# EAGLE design 10BASE-T1L_3 (EAGLE 9.6.2)

## Sheet 1 of 2
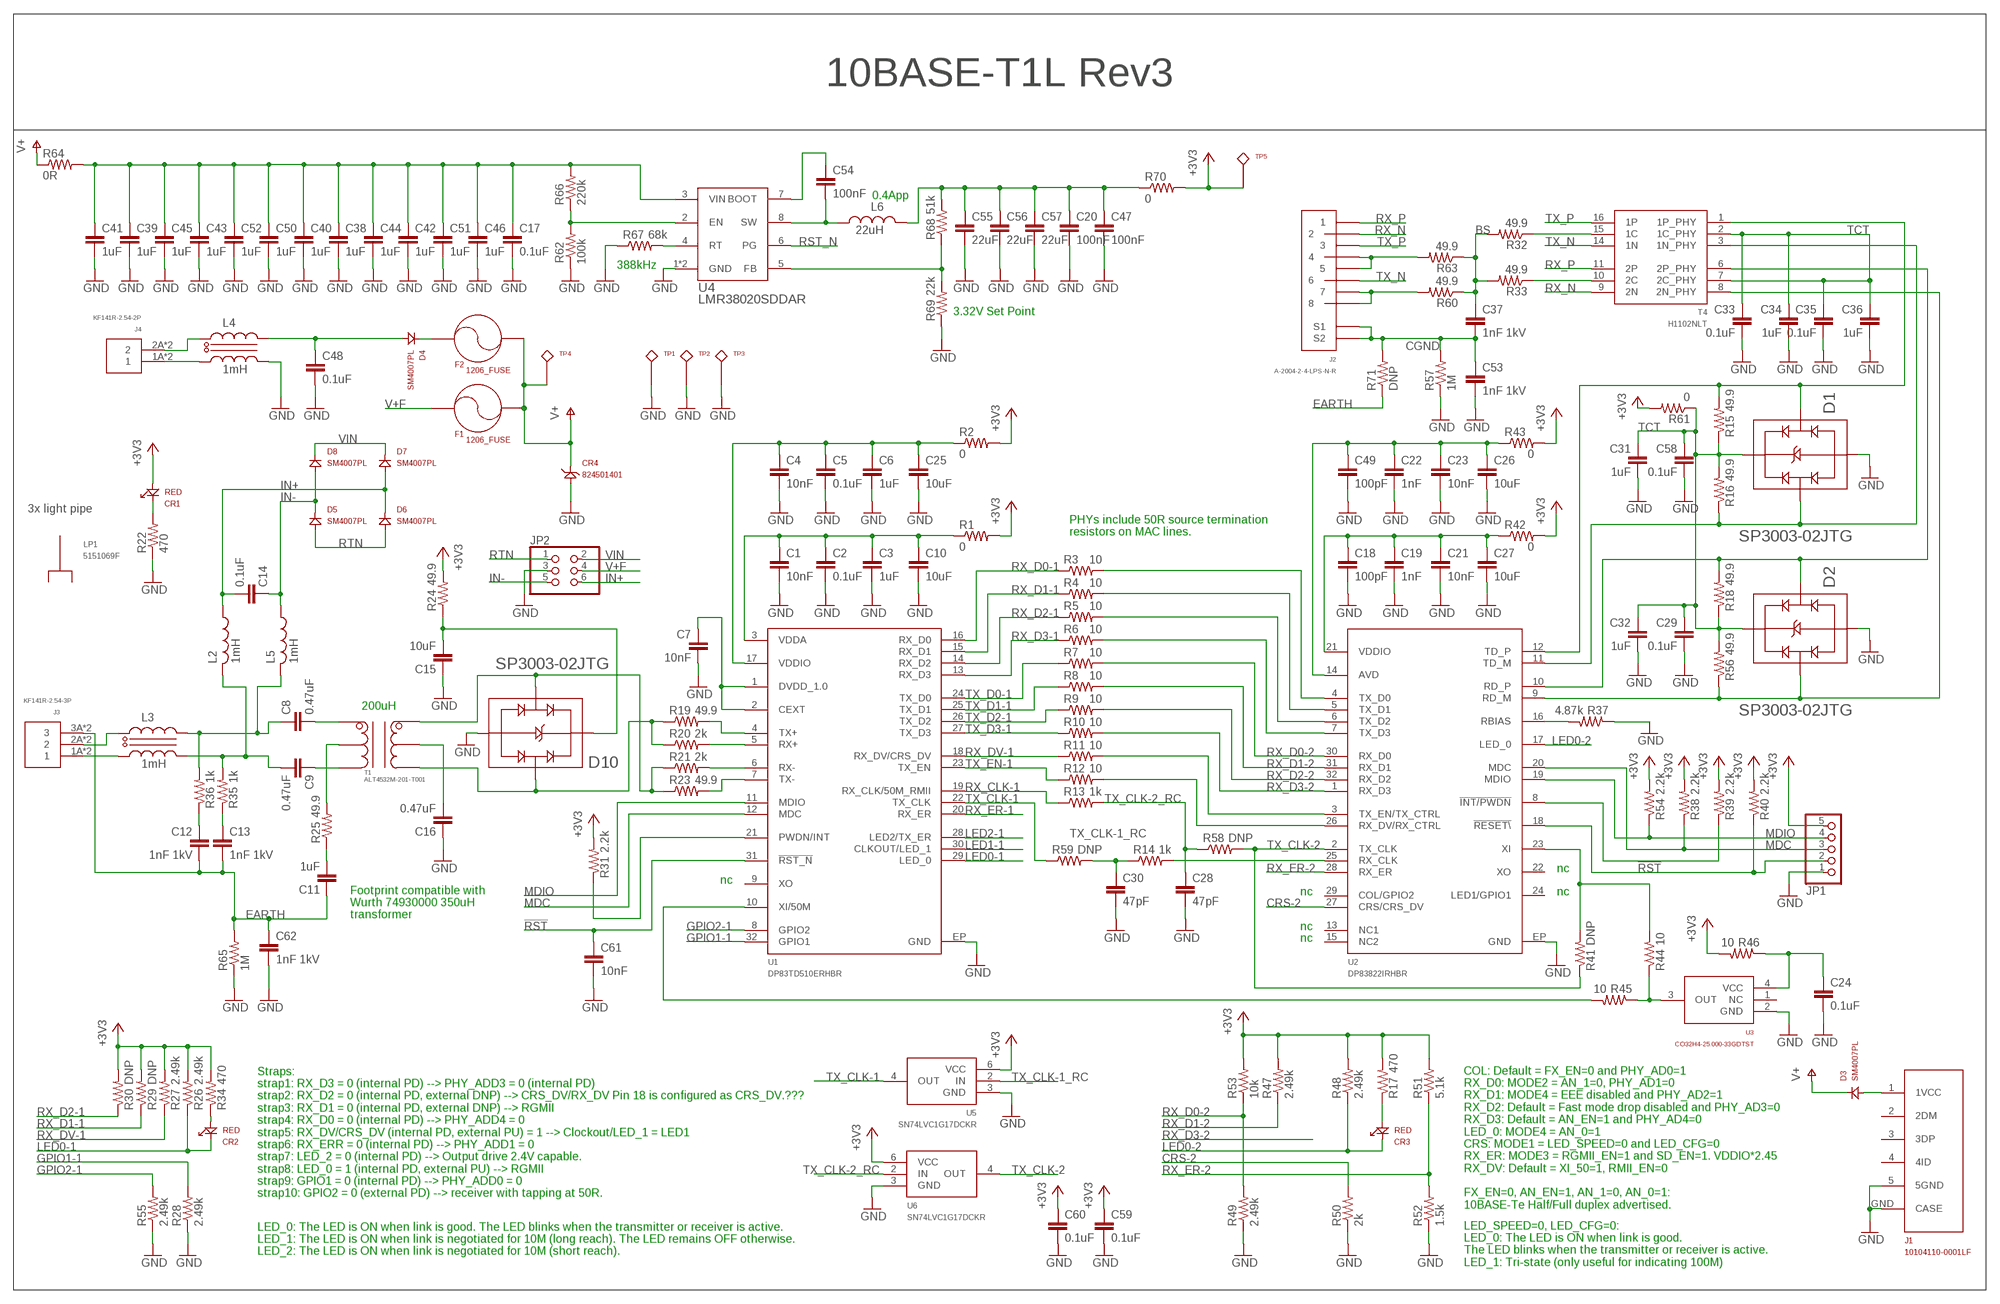
[diagram p0: schematic, sheet 1]

### Parts
C1  10nF  0402_CAPACITOR  [0402_INDUCTOR]
C2  0.1uF  0402_CAPACITOR  [0402_INDUCTOR]
C3  1uF  0402_CAPACITOR  [0402_INDUCTOR]
C4  10nF  0402_CAPACITOR  [0402_INDUCTOR]
C5  0.1uF  0402_CAPACITOR  [0402_INDUCTOR]
C6  1uF  0402_CAPACITOR  [0402_INDUCTOR]
C7  10nF  0402_CAPACITOR  [0402_INDUCTOR]
C8  0.47uF  0603_CAPACITOR  [0603]
C9  0.47uF  0603_CAPACITOR  [0603]
C10  10uF  0603_CAPACITOR  [0603]
C11  1uF  0603_CAPACITOR  [0603]
C12  1nF 1kV  C-EUC1206  [C1206]
C13  1nF 1kV  C-EUC1206  [C1206]
C14  0.1uF  0603_CAPACITOR  [0603]
C15  10uF  0603_CAPACITOR  [0603]
C16  0.47uF  0603_CAPACITOR  [0603]
C17  0.1uF  0603_CAPACITOR  [0603]
C18  100pF  0402_CAPACITOR  [0402_INDUCTOR]
C19  1nF  0402_CAPACITOR  [0402_INDUCTOR]
C20  100nF  0603_CAPACITOR  [0603]
C21  10nF  0402_CAPACITOR  [0402_INDUCTOR]
C22  1nF  0402_CAPACITOR  [0402_INDUCTOR]
C23  10nF  0402_CAPACITOR  [0402_INDUCTOR]
C24  0.1uF  0402_CAPACITOR  [0402_INDUCTOR]
C25  10uF  0603_CAPACITOR  [0603]
C26  10uF  0603_CAPACITOR  [0603]
C27  10uF  0603_CAPACITOR  [0603]
C28  47pF  0402_CAPACITOR  [0402_INDUCTOR]
C29  0.1uF  0402_CAPACITOR  [0402_INDUCTOR]
C30  47pF  0402_CAPACITOR  [0402_INDUCTOR]
C31  1uF  0402_CAPACITOR  [0402_INDUCTOR]
C32  1uF  0402_CAPACITOR  [0402_INDUCTOR]
C33  0.1uF  0402_CAPACITOR  [0402_INDUCTOR]
C34  1uF  0402_CAPACITOR  [0402_INDUCTOR]
C35  0.1uF  0402_CAPACITOR  [0402_INDUCTOR]
C36  1uF  0402_CAPACITOR  [0402_INDUCTOR]
C37  1nF 1kV  C-EUC1206  [C1206]
C38  1uF  C-EUC1206  [C1206]
C39  1uF  C-EUC1206  [C1206]
C40  1uF  C-EUC1206  [C1206]
C41  1uF  C-EUC1206  [C1206]
C42  1uF  C-EUC1206  [C1206]
C43  1uF  C-EUC1206  [C1206]
C44  1uF  C-EUC1206  [C1206]
C45  1uF  C-EUC1206  [C1206]
C46  1uF  C-EUC1206  [C1206]
C47  100nF  0603_CAPACITOR  [0603]
C48  0.1uF  0603_CAPACITOR  [0603]
C49  100pF  0402_CAPACITOR  [0402_INDUCTOR]
C50  1uF  C-EUC1206  [C1206]
C51  1uF  C-EUC1206  [C1206]
C52  1uF  C-EUC1206  [C1206]
C53  1nF 1kV  C-EUC1206  [C1206]
C54  100nF  0603_CAPACITOR  [0603]
C55  22uF  C-EUC1206  [C1206]
C56  22uF  C-EUC1206  [C1206]
C57  22uF  C-EUC1206  [C1206]
C58  0.1uF  0402_CAPACITOR  [0402_INDUCTOR]
C59  0.1uF  0402_CAPACITOR  [0402_INDUCTOR]
C60  0.1uF  0402_CAPACITOR  [0402_INDUCTOR]
C61  10nF  0402_CAPACITOR  [0402_INDUCTOR]
C62  1nF 1kV  C-EUC1206  [C1206]
CR1  RED  150060RS75000  [0603_DIODE]
CR2  RED  150060RS75000  [0603_DIODE]
CR3  RED  150060RS75000  [0603_DIODE]
CR4  824501401  [DO-214AC]
D1  SP3003-02JTG  [SC-70-5]
D2  SP3003-02JTG  [SC-70-5]
D3  SM4007PL  [SOD123(AK)]
D4  SM4007PL  [SOD123(AK)]
D5  SM4007PL  [SOD123(AK)]
D6  SM4007PL  [SOD123(AK)]
D7  SM4007PL  [SOD123(AK)]
D8  SM4007PL  [SOD123(AK)]
D10  SP3003-02JTG  [SC-70-5]
F1  1206_FUSE  [1206]
F2  1206_FUSE  [1206]
J1  10104110-0001LF  [MICRO_USB]
J2  A-2004-2-4-LPS-N-R  [A-2004-2-4-LPS-N-R]
J3  KF141R-2.54-3P  [KF141R-2.54-3P]
J4  KF141R-2.54-2P  [KF141R-2.54-2P]
JP1  PINHD-1X5  [1X05]
JP2  PINHD-2X3  [2X03]
L2  1mH  SNR5040TYD102M  [SNR5040]
L3  1mH  SMCM090605-102  [SMCM090605]
L4  1mH  SMCM090605-102  [SMCM090605]
L5  1mH  SNR5040TYD102M  [SNR5040]
L6  22uH  TMPC0603H-220MG-D  [TMPC0603H]
LP1  5151069F  [5151069F]
R1  0  0603_RESISTOR  [0603]
R2  0  0603_RESISTOR  [0603]
R3  10  0402_RESISTOR  [R0402]
R4  10  0402_RESISTOR  [R0402]
R5  10  0402_RESISTOR  [R0402]
R6  10  0402_RESISTOR  [R0402]
R7  10  0402_RESISTOR  [R0402]
R8  10  0402_RESISTOR  [R0402]
R9  10  0402_RESISTOR  [R0402]
R10  10  0402_RESISTOR  [R0402]
R11  10  0402_RESISTOR  [R0402]
R12  10  0402_RESISTOR  [R0402]
R13  1k  0402_RESISTOR  [R0402]
R14  1k  0402_RESISTOR  [R0402]
R15  49.9  0402_RESISTOR  [R0402]
R16  49.9  0402_RESISTOR  [R0402]
R17  470  0603_RESISTOR  [0603]
R18  49.9  0402_RESISTOR  [R0402]
R19  49.9  0402_RESISTOR  [R0402]
R20  2k  0402_RESISTOR  [R0402]
R21  2k  0402_RESISTOR  [R0402]
R22  470  0603_RESISTOR  [0603]
R23  49.9  0402_RESISTOR  [R0402]
R24  49.9  0603_RESISTOR  [0603]
R25  49.9  0603_RESISTOR  [0603]
R26  2.49k  0402_RESISTOR  [R0402]
R27  2.49k  0402_RESISTOR  [R0402]
R28  2.49k  0402_RESISTOR  [R0402]
R29  DNP  0402_RESISTOR  [R0402]
R30  DNP  0402_RESISTOR  [R0402]
R31  2.2k  0402_RESISTOR  [R0402]
R32  49.9  0402_RESISTOR  [R0402]
R33  49.9  0402_RESISTOR  [R0402]
R34  470  0603_RESISTOR  [0603]
R35  1k  0603_RESISTOR  [0603]
R36  1k  0603_RESISTOR  [0603]
R37  4.87k  0402_RESISTOR  [R0402]
R38  2.2k  0402_RESISTOR  [R0402]
R39  2.2k  0402_RESISTOR  [R0402]
R40  2.2k  0402_RESISTOR  [R0402]
R41  DNP  0402_RESISTOR  [R0402]
R42  0  0603_RESISTOR  [0603]
R43  0  0603_RESISTOR  [0603]
R44  10  0402_RESISTOR  [R0402]
R45  10  0402_RESISTOR  [R0402]
R46  10  0402_RESISTOR  [R0402]
R47  2.49k  0402_RESISTOR  [R0402]
R48  2.49k  0402_RESISTOR  [R0402]
R49  2.49k  0402_RESISTOR  [R0402]
R50  2k  0402_RESISTOR  [R0402]
R51  5.1k  0402_RESISTOR  [R0402]
R52  1.5k  0402_RESISTOR  [R0402]
R53  10k  0402_RESISTOR  [R0402]
R54  2.2k  0402_RESISTOR  [R0402]
R55  2.49k  0402_RESISTOR  [R0402]
R56  49.9  0402_RESISTOR  [R0402]
R57  1M  1206_RESISTOR  [1206]
R58  DNP  0402_RESISTOR  [R0402]
R59  DNP  0402_RESISTOR  [R0402]
R60  49.9  0402_RESISTOR  [R0402]
R61  0  0603_RESISTOR  [0603]
R62  100k  0603_RESISTOR  [0603]
R63  49.9  0402_RESISTOR  [R0402]
R64  0R  1206_RESISTOR  [1206]
R65  1M  1206_RESISTOR  [1206]
R66  220k  0603_RESISTOR  [0603]
R67  68k  0603_RESISTOR  [0603]
R68  51k  0603_RESISTOR  [0603]
R69  22k  0603_RESISTOR  [0603]
R70  0  0603_RESISTOR  [0603]
R71  DNP  0603_RESISTOR  [0603]
T1  ALT4532M-201-T001  [TDK_ALT]
T4  H1102NLT  [H1102NLT]
TP1  5011  [5010]
TP2  5011  [5010]
TP3  5011  [5010]
TP4  5010  [5010]
TP5  5010  [5010]
U1  DP83TD510ERHBR  [QFN32-55_TI]
U2  DP83822IRHBR  [QFN32-55_TI]
U3  CO32H4-25.000-33GDTST  [3.2X2.5_4SMD]
U4  LMR38020SDDAR  [SOIC8_TP_TI]
U5  SN74LVC1G17DCKR  [SC-70]
U6  SN74LVC1G17DCKR  [SC-70]

### Nets
3V3R: C20.1 C47.1 C55.1 C56.1 C57.1 L6.P$1 R68.2 R70.1
!RST [Diff]: C61.P$1 JP1.2 R40.1 U1.31(!RST_N) U2.18(!RESET\)
+3V3: C59.P$1 C60.P$1 CR1.A JP1.5 R1.2 R2.2 R17.2 R24.2 R26.2 R27.2 R29.2 R30.2 R31.2 R34.2 R38.2 R39.2 R40.2 R42.2 R43.2 R46.2 R47.2 R48.2 R51.2 R53.2 R54.2 R61.2 R70.2 TP5.P$1 U5.6(VCC) U6.6(VCC)
BS: C37.1 R32.2 R33.2 R60.1 R63.1
CEXT_L: C7.P$1 U1.1(DVDD_1.0) U1.2(CEXT)
CGND: C37.2 C53.1 J2.S1 J2.S2 R57.2 R71.2
CRS-2: R50.2 U2.27(CRS/CRS_DV)
EARTH: C11.1 C12.2 C13.2 C62.1 J3.3A J3.3B R65.2 R71.1
GND: C1.P$2 C2.P$2 C3.P$2 C4.P$2 C5.P$2 C6.P$2 C7.P$2 C10.2 C15.1 C16.1 C17.2 C18.P$2 C19.P$2 C20.2 C21.P$2 C22.P$2 C23.P$2 C24.P$2 C25.2 C26.2 C27.2 C28.P$2 C29.P$2 C30.P$2 C31.P$2 C32.P$2 C33.P$2 C34.P$2 C35.P$2 C36.P$2 C38.2 C39.2 C40.2 C41.2 C42.2 C43.2 C44.2 C45.2 C46.2 C47.2 C48.2 C49.P$2 C50.2 C51.2 C52.2 C53.2 C55.2 C56.2 C57.2 C58.P$2 C59.P$2 C60.P$2 C61.P$2 C62.2 CR4.A D1.2(GND) D2.2(GND) D10.2(GND) J1.5(5GND) J1.GND(CASE) JP1.1 JP2.3 L4.OUT2(2OUT) R22.1 R28.1 R37.1 R49.1 R50.1 R52.1 R55.1 R57.1 R62.1 R65.1 R67.1 R69.1 TP1.P$1 TP2.P$1 TP3.P$1 U1.EP(GND) U2.EP(GND) U3.2(GND) U4.1(GND) U4.TP(GND) U5.3(GND) U6.3(GND)
GPIO1-1: R28.2 U1.32(GPIO1)
GPIO2-1: R55.2 U1.8(GPIO2)
IN+: C14.2 D6.K D7.A JP2.6 L2.P$1
IN+L: C9.2 L2.P$2 L3.OUT2(2OUT) R35.2
IN-: C14.1 D5.K D8.A JP2.5 L5.P$1
IN-L: C8.1 L3.OUT1(1OUT) L5.P$2 R36.2
LED0-1: CR2.K R26.1 U1.29(LED_0)
LED0-2: CR3.K R48.1 U2.17(LED_0)
LED1-1: U1.30(CLKOUT/LED_1)
LED2-1: U1.28(LED2/TX_ER)
MDC: JP1.3 R38.1 U1.12(MDC) U2.20(MDC)
MDIO: JP1.4 R54.1 U1.11(MDIO) U2.19(MDIO)
N$1: C48.1 D4.A L4.OUT1(1OUT)
N$2: C8.2 T1.1
N$3: CR3.A R17.1
N$4: J2.4 J2.5 R63.2
N$5: J2.7 J2.8 R60.2
N$6: CR2.A R34.1
N$9: R31.1 U1.21(PWDN/INT)
N$10: D3.A J1.1(1VCC)
N$12: J4.1A J4.1B L4.IN2(2IN)
N$13: R14.2 U2.25(RX_CLK)
N$14: C9.1 T1.2
N$16: R25.2 T1.6
N$19: CR1.K R22.2
N$23: D4.K F2.1
N$24: R12.2 U2.26(RX_DV/RX_CTRL)
N$25: R11.2 U2.3(TX_EN/TX_CTRL)
N$27: R62.2 R66.1 U4.2(EN)
N$29: R32.1 T4.15(1C)
N$30: R6.2 U2.7(TX_D3)
N$31: R5.2 U2.6(TX_D2)
N$32: R4.2 U2.5(TX_D1)
N$33: R3.2 U2.4(TX_D0)
N$34: J4.2A J4.2B L4.IN1(1IN)
N$36: J3.1A J3.1B L3.IN2(2IN)
N$37: C11.2 R25.1
N$38: R41.2 R44.2 U2.23(XI)
N$40: C16.2 T1.3
N$42: C12.1 R36.1
N$48: C13.1 R35.1
N$49: J3.2A J3.2B L3.IN1(1IN)
N$50: C15.2 D10.3(VCC) R24.1
N$58: R39.1 U2.8(!INT/PWDN)
N$59: R68.1 R69.2 U4.5(FB)
N$60: R37.2 U2.16(RBIAS)
N$61: R44.1 R45.1 U3.3(OUT)
N$62: C24.P$1 R46.1 U3.4(VCC)
N$63: R45.2 U1.10(XI/50M)
N$64: R33.1 T4.10(2C)
N$68: C54.1 U4.7(BOOT)
N$71: R67.2 U4.4(RT)
RD_N [Diff]: D2.5(IO1) R56.1 T4.8(2N_PHY) U2.9(RD_M)
RD_P [Diff]: D2.4(IO2) R18.2 T4.6(2P_PHY) U2.10(RD_P)
RST_N [Diff]: U4.6(PG)
RTN: D5.A D6.A JP2.1
RX_CLK-1: R13.1 U1.19(RX_CLK/50M_RMII)
RX_D0-1: R3.1 U1.16(RX_D0)
RX_D0-2: R7.2 R49.2 R53.1 U2.30(RX_D0)
RX_D1-1: R4.1 R29.1 U1.15(RX_D1)
RX_D1-2: R8.2 R47.1 U2.31(RX_D1)
RX_D2-1: R5.1 R30.1 U1.14(RX_D2)
RX_D2-2: R9.2 U2.32(RX_D2)
RX_D3-1: R6.1 U1.13(RX_D3)
RX_D3-2: R10.2 U2.1(RX_D3)
RX_DV-1: R11.1 R27.1 U1.18(RX_DV/CRS_DV)
RX_ER-1: U1.20(RX_ER)
RX_ER-2: R51.1 R52.2 U2.28(RX_ER)
RX_N: J2.2 T4.9(2N)
RX_P: J2.1 T4.11(2P)
RXR_N [Diff]: R21.2 U1.6(RX-)
RXR_P [Diff]: R20.2 U1.5(RX+)
SW: C54.2 L6.P$2 U4.8(SW)
T1L_N [Diff]: D10.5(IO1) R21.1 R23.1 T1.5
T1L_P [Diff]: D10.4(IO2) R19.1 R20.1 T1.4
TCT: C29.P$1 C31.P$1 C32.P$1 C33.P$1 C34.P$1 C35.P$1 C36.P$1 C58.P$1 D1.3(VCC) D2.3(VCC) R15.1 R16.2 R18.1 R56.2 R61.1 T4.2(1C_PHY) T4.7(2C_PHY)
TD_N [Diff]: D1.5(IO1) R16.1 T4.3(1N_PHY) U2.11(TD_M)
TD_P [Diff]: D1.4(IO2) R15.2 T4.1(1P_PHY) U2.12(TD_P)
TX_CLK-1: R59.1 U1.22(TX_CLK) U5.4(OUT)
TX_CLK-1_RC: C30.P$1 R14.1 R59.2 U5.2(IN)
TX_CLK-2: R41.1 R58.2 U2.2(TX_CLK) U6.4(OUT)
TX_CLK-2_RC: C28.P$1 R13.2 R58.1 U6.2(IN)
TX_D0-1: R7.1 U1.24(TX_D0)
TX_D1-1: R8.1 U1.25(TX_D1)
TX_D2-1: R9.1 U1.26(TX_D2)
TX_D3-1: R10.1 U1.27(TX_D3)
TX_EN-1: R12.1 U1.23(TX_EN)
TX_N: J2.6 T4.14(1N)
TX_P: J2.3 T4.16(1P)
TXR_N [Diff]: R23.2 U1.7(TX-)
TXR_P [Diff]: R19.2 U1.4(TX+)
V+ [HV]: CR4.C(K) D3.K F1.2 F2.2 R64.1 TP4.P$1
V+F: F1.1 JP2.4
V+R [HV]: C17.1 C38.1 C39.1 C40.1 C41.1 C42.1 C43.1 C44.1 C45.1 C46.1 C50.1 C51.1 C52.1 R64.2 R66.2 U4.3(VIN)
VDDA_L: C1.P$1 C2.P$1 C3.P$1 C10.1 R1.1 U1.3(VDDA)
VDDA_L1: C18.P$1 C19.P$1 C21.P$1 C27.1 R42.1 U2.21(VDDIO)
VDDIO_L: C4.P$1 C5.P$1 C6.P$1 C25.1 R2.1 U1.17(VDDIO)
VDDIO_L1: C22.P$1 C23.P$1 C26.1 C49.P$1 R43.1 U2.14(AVD)
VIN: D7.K D8.K JP2.2
Unconnected: J1.2(2DM) J1.3(3DP) J1.4(4ID) U1.9(XO) U2.13(NC1) U2.15(NC2) U2.22(XO) U2.24(LED1/GPIO1) U2.29(COL/GPIO2) U3.1(NC)

### Notes on the sheet
- 10BASE-T1L Rev3
- 0.4App
- 388kHz
- 3.32V Set Point
- 3x light pipe
- PHYs include 50R source termination 
  resistors on MAC lines.
- 200uH
- nc
- nc
- nc | nc
- Footprint compatible with
  Wurth 74930000 350uH
  transformer
- nc
- nc
- Straps:
  strap1: RX_D3 = 0 (internal PD) --> PHY_ADD3 = 0 (internal PD) 
  strap2: RX_D2 = 0 (internal PD, external DNP) --> CRS_DV/RX_DV Pin 18 is configured as CRS_DV.???
  strap3: RX_D1 = 0 (internal PD, external DNP) --> RGMII
  strap4: RX_D0 = 0 (internal PD) --> PHY_ADD4 = 0
  strap5: RX_DV/CRS_DV (internal PD, external PU) = 1 --> Clockout/LED_1 = LED1
  strap6: RX_ERR = 0 (internal PD) --> PHY_ADD1 = 0
  strap7: LED_2 = 0 (internal PD) --> Output drive 2.4V capable.
  strap8: LED_0 = 1 (internal PD, external PU) --> RGMII
  strap9: GPIO1 = 0 (internal PD) --> PHY_ADD0 = 0
  strap10: GPIO2 = 0 (external PD) --> receiver with tapping at 50R.
- COL: Default = FX_EN=0 and PHY_AD0=1
  RX_D0: MODE2 = AN_1=0, PHY_AD1=0
  RX_D1: MODE4 = EEE disabled and PHY_AD2=1
  RX_D2: Default = Fast mode drop disabled and PHY_AD3=0
  RX_D3: Default = AN_EN=1 and PHY_AD4=0
  LED_0: MODE4 = AN_0=1
  CRS: MODE1 = LED_SPEED=0 and LED_CFG=0
  RX_ER: MODE3 = RGMII_EN=1 and SD_EN=1. VDDIO*2.45
  RX_DV: Default = XI_50=1, RMII_EN=0
  
  FX_EN=0, AN_EN=1, AN_1=0, AN_0=1:
  10BASE-Te Half/Full duplex advertised.
- LED_0: The LED is ON when link is good. The LED blinks when the transmitter or receiver is active. 
  LED_1: The LED is ON when link is negotiated for 10M (long reach). The LED remains OFF otherwise. 
  LED_2: The LED is ON when link is negotiated for 10M (short reach).
- LED_SPEED=0, LED_CFG=0:
  LED_0: The LED is ON when link is good. 
  The LED blinks when the transmitter or receiver is active. 
  LED_1: Tri-state (only useful for indicating 100M)

## Sheet 2 of 2

## Library data of the parts
C1-C7 C18 C19 C21-C24 C28-C36 C49 C58-C61 = ruark2:0402_CAPACITOR: 0402 select capacitor; VALUE: sel
C8-C11 C14-C17 C20 C25-C27 C47 C48 C54 = ruark2:0603_CAPACITOR: 0603 Capacitor -- WARNING: NO DEFINED VALUE OR PART NUMBER; VALUE: sel
C12 C13 C37-C46 C50-C53 C55-C57 C62 = rcl:C-EU: CAPACITOR, European symbol; SPICEPREFIX: C
CR1-CR3 = ruark2:150060RS75000: Red 625nm LED Indication - Discrete 2V 0603 (1608 Metric); PARTNO: 732-4978-1-ND
CR4 = ruark2:824501401: 64.5V Clamp 6.1A Ipp Tvs Diode Surface Mount DO-214AC; PARTNO: 732-9960-1-ND
D1 D2 D10 = ruark2:SP3003-02JTG: 15V Clamp 2.5A (8/20µs) Ipp Tvs Diode Surface Mount SC-70-5 JLCPCB: C151302; PARTNO: F3301CT-ND
D3-D8 = ruark2:SM4007PL: 1A 1kV 1.1V@1A SOD-123FL Diodes - General Purpose ROHS JLCPCB: C64898
F1 F2 = ruark2:1206_FUSE
J1 = ruark2:10104110-0001LF: USB - micro B USB 2.0 Receptacle Connector 5 Position Surface Mount, Right Angle; PARTNO: 609-4052-1-ND
J2 = ruark2:A-2004-2-4-LPS-N-R: Jack Modular Connector 8p8c (RJ45, Ethernet) 90° Angle (Right) Shielded Asian alternate: RCH RC00994; PARTNO: AE10387-ND
J3 = ruark2:KF141R-2.54-3P: 1 2.54mm 20~26 2A Through Hole 150V 3 Push-Pull,P=2.54mm Spring Clamp System Terminal Block ROHS
J4 = ruark2:KF141R-2.54-2P: 1 2.54mm 20~26 2A Through Hole 150V 2 Push-Pull,P=2.54mm Spring Clamp System Terminal Block ROHS; JLC: C475124
JP1 = pinhead:PINHD-1X5: PIN HEADER
JP2 = pinhead:PINHD-2X3: PIN HEADER
L2 L5 = ruark2:SNR5040TYD102M: 1mH ±20% SMD Power Inductors ROHS 200mA; JLCPCB: C2827402
L3 L4 = ruark2:SMCM090605-102: 1000uH@100kHz 6kΩ@10MHz 0.31Ω 2 SMD,9.0x6.0x5.0mm Common Mode Filters ROHS
L6 = ruark2:TMPC0603H-220MG-D: 2A 22uH ±20% SMD Power Inductors ROHS
LP1 = ruark2:5151069F: Light Pipe 3 Wide Clear Rigid Board Mount, Press Fit, Right Angle; PARTNO: 350-2182-ND
R1 R2 R17 R22 R24 R25 R34-R36 R42 R43 R61 R62 R66-R71 = ruark2:0603_RESISTOR: 0603 Resistor -- WARNING: NO DEFINED PART NUMBER OR VALUE; VALUE: sel
R3-R16 R18-R21 R23 R26-R33 R37-R41 R44-R56 R58-R60 R63 = ruark2:0402_RESISTOR: 0402 Resistor -- WARNING: NO DEFINED PART NUMBER OR VALUE
R57 R64 R65 = ruark2:1206_RESISTOR: NO DEFINED PN; VALUE: sel
T1 = ruark2:ALT4532M-201-T001: 200µH LAN Pulse Transformer 1CT:1CT Surface Mount JLCPCB: C2845101; PARTNO: 445-15085-1-ND
T4 = ruark2:H1102NLT
TP1-TP3 = ruark2:5011: Black PC Test Point, Multipurpose Phosphor Bronze, Silver Plating 0.063" (1.60mm) Hole Diameter Mounting Type; PARTNO: 36-5011-ND
TP4 TP5 = ruark2:5010: Red PC Test Point, Multipurpose Phosphor Bronze, Silver Plating 0.063" (1.60mm) Hole Diameter Mounting Type; PARTNO: 36-5010-ND
U1 = ruark2:DP83TD510ERHBR: 1/1 Transceiver 10BASE-T1L IEEE 802.3 32-VQFN (5x5); PARTNO: 296-DP83TD510ERHBRCT-ND
U2 = ruark2:DP83822IRHBR: 10/100 Ethernet PHY RGMII/RMII/MII; PARTNO: 296-44794-1-ND
U3 = ruark2:CO32H4-25.000-33GDTST: 3.3V~3.3V ±50ppm 25MHz HCMOS SMD3225-4P Oscillators ROHS 4-SMD, No Lead
U4 = ruark2:LMR38020SDDAR: Buck Switching Regulator IC Positive Adjustable 1V 1 Output 2A 8-PowerSOIC (0.154", 3.90mm Width); PARTNO: 296-LMR38020SDDARCT-ND
U5 U6 = ruark2:SN74LVC1G17DCKR: Buffer, Non-Inverting 1 Element 1 Bit per Element Push-Pull Output SC-70-5; JLCPCB: C10425; PARTNO: 296-11934-1-ND

## Net classes
1 HV: clearance 0.406 mm
2 Diff: width 0.18 mm, clearance 0.152 mm

## Board
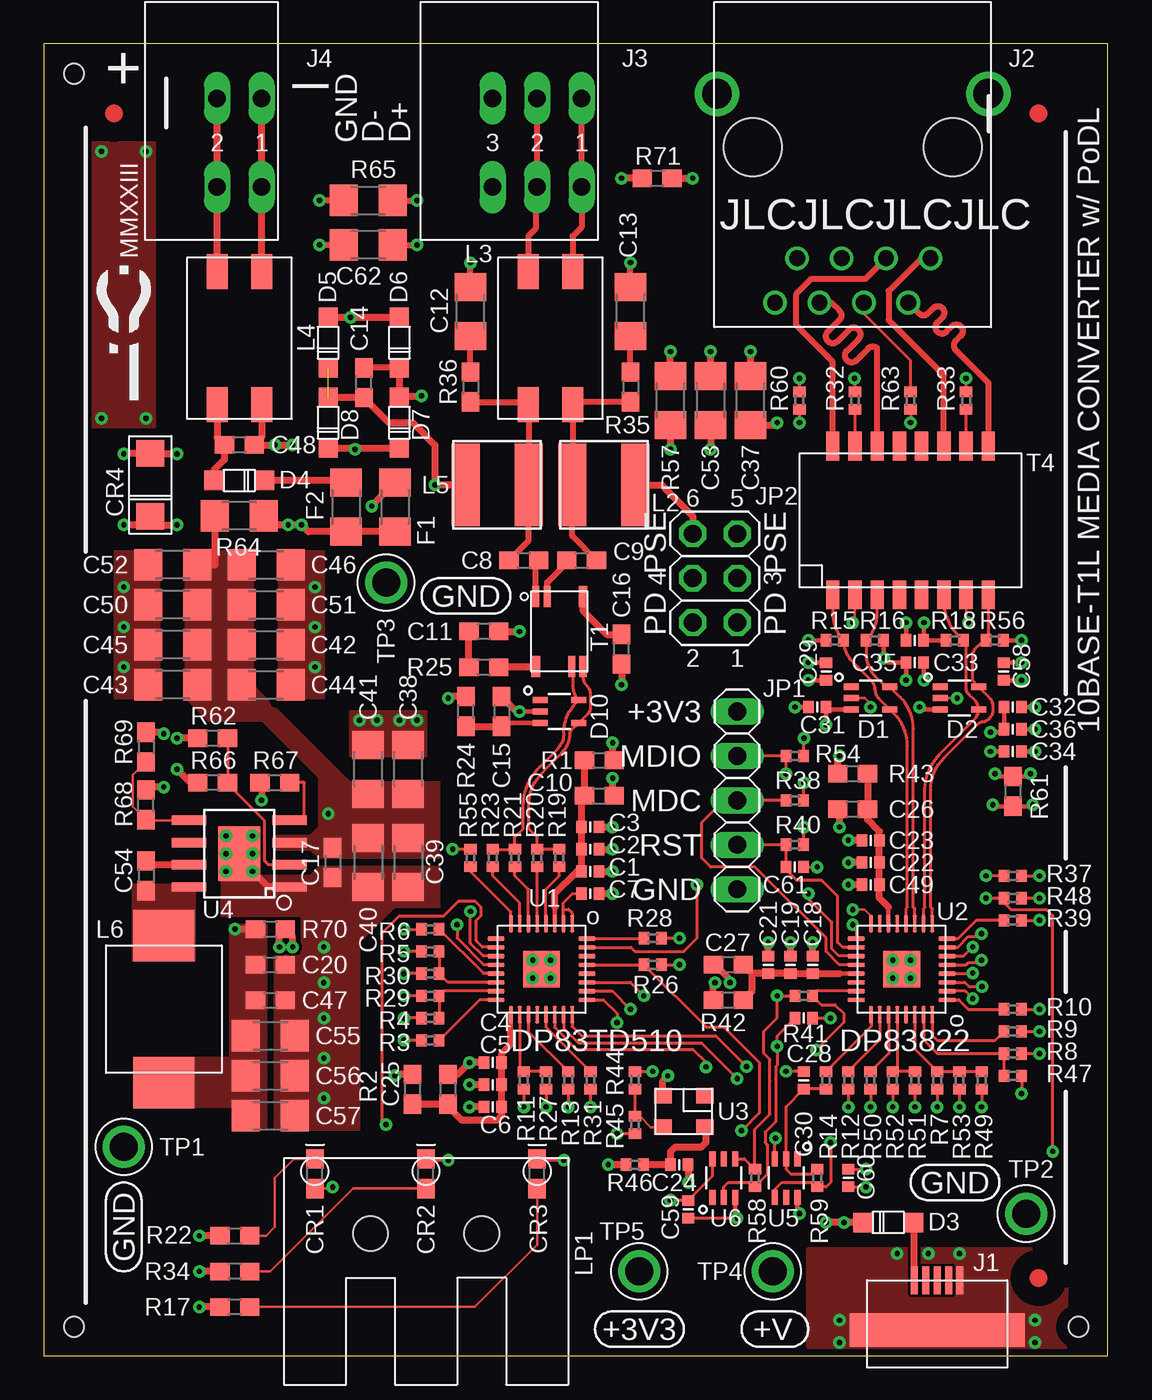
[diagram p1: board, top side]
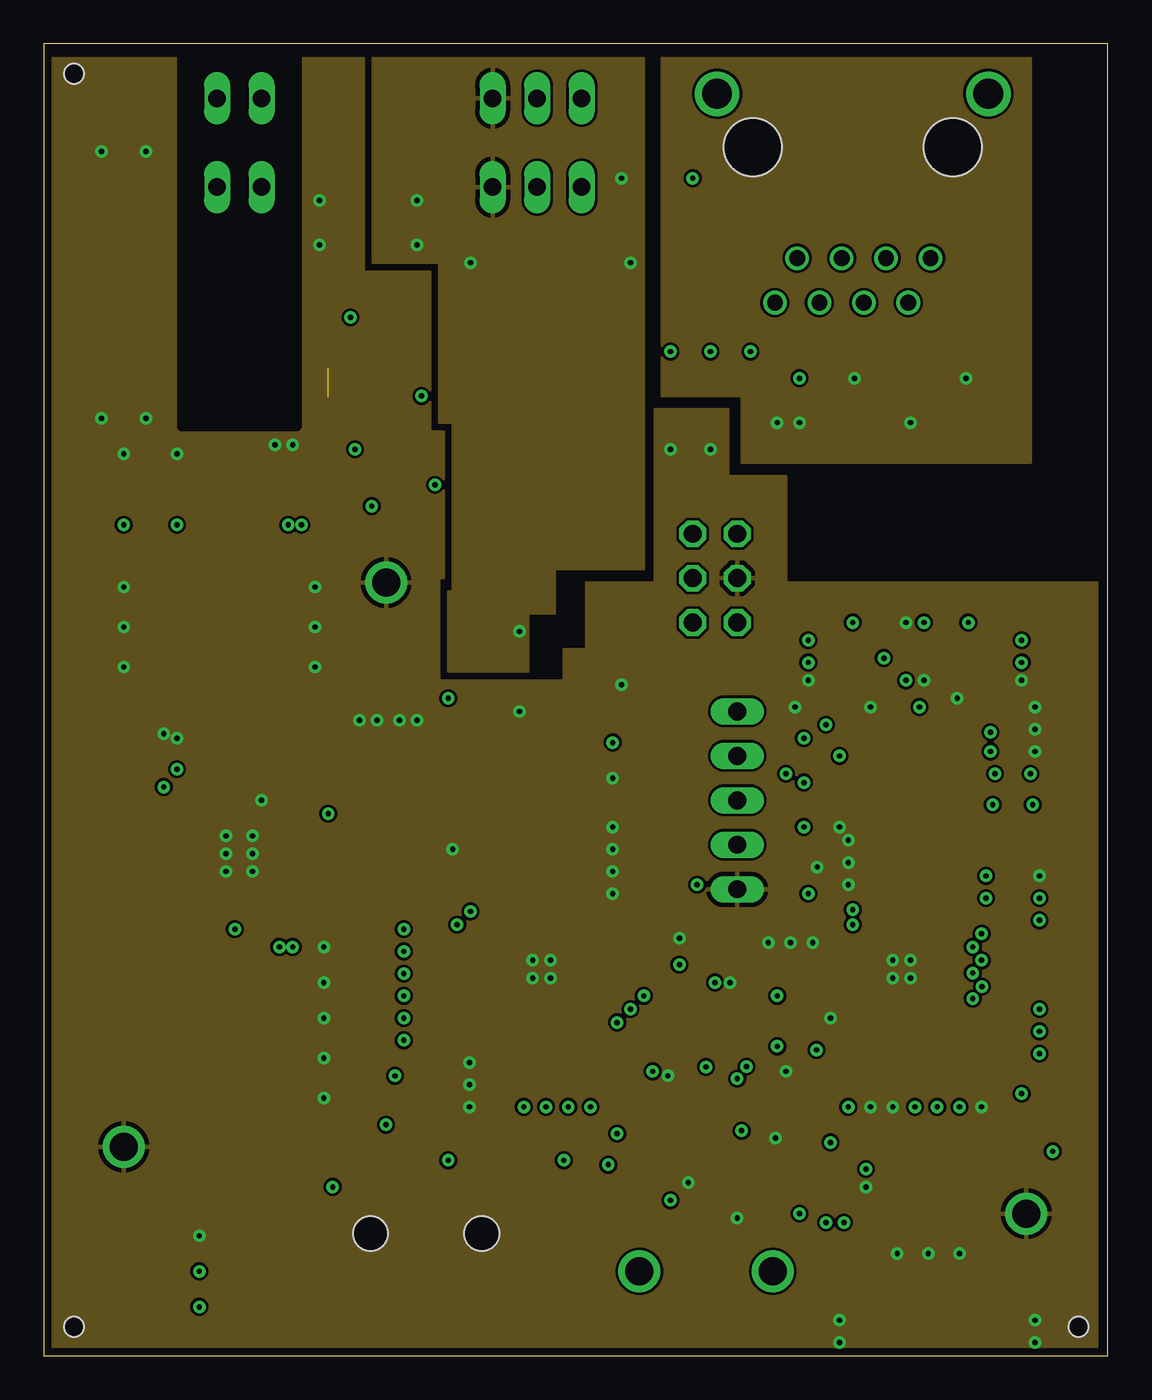
[diagram p2: board, inner layer Route2]
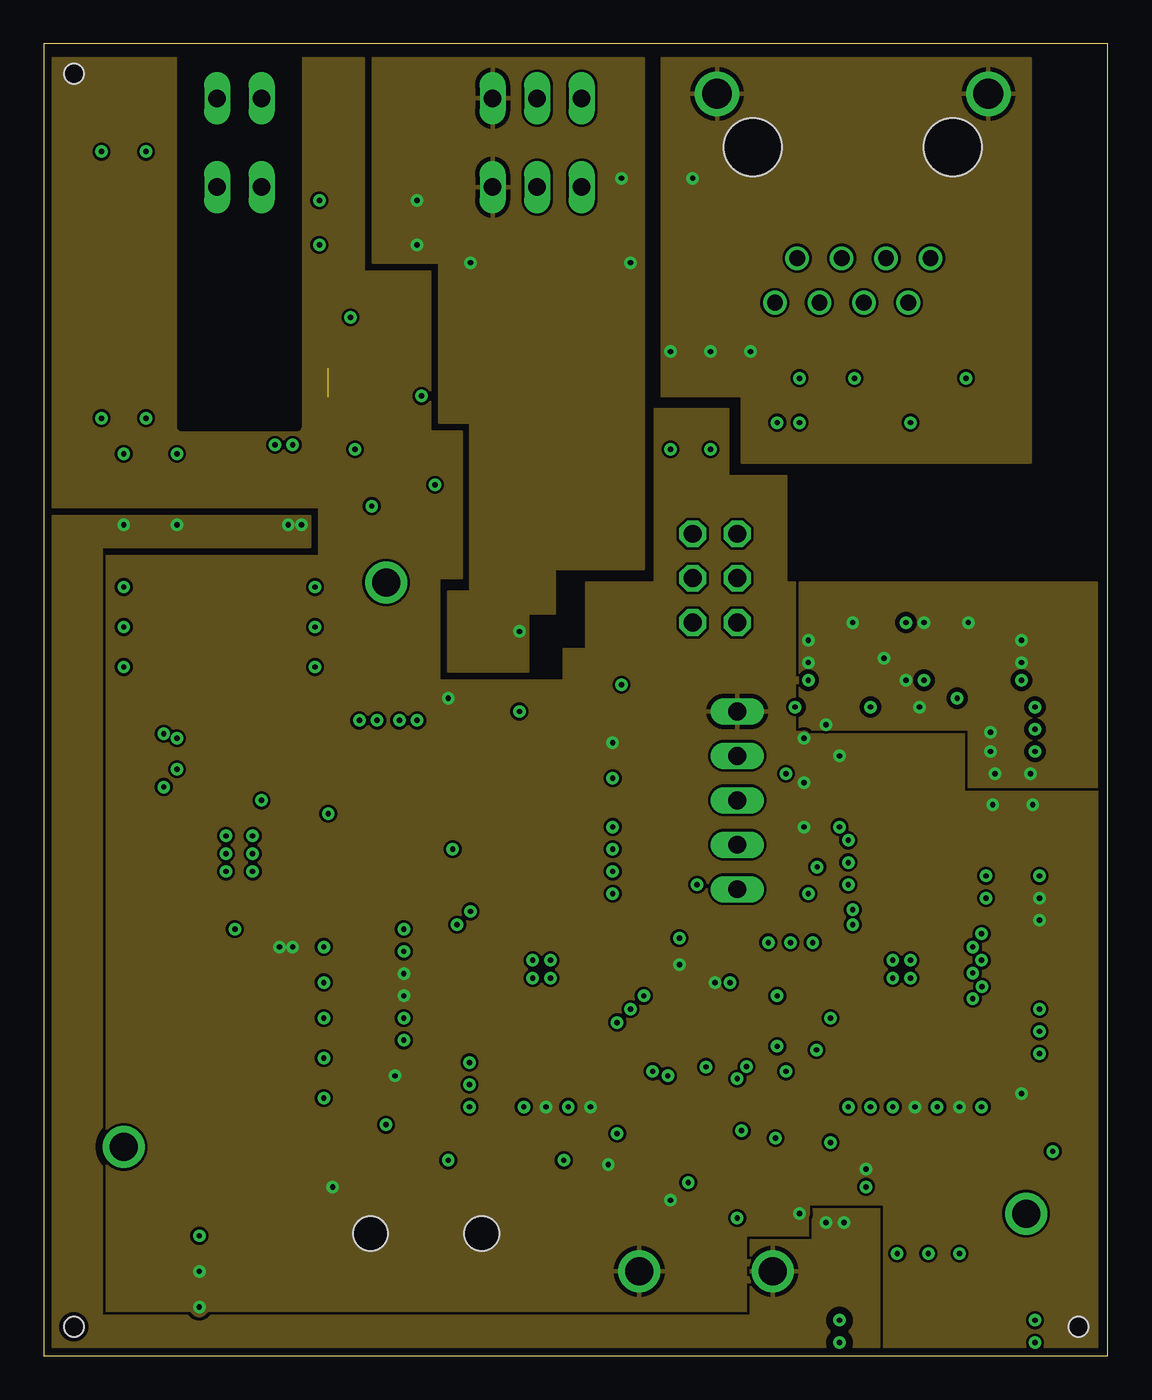
[diagram p3: board, inner layer Route15]
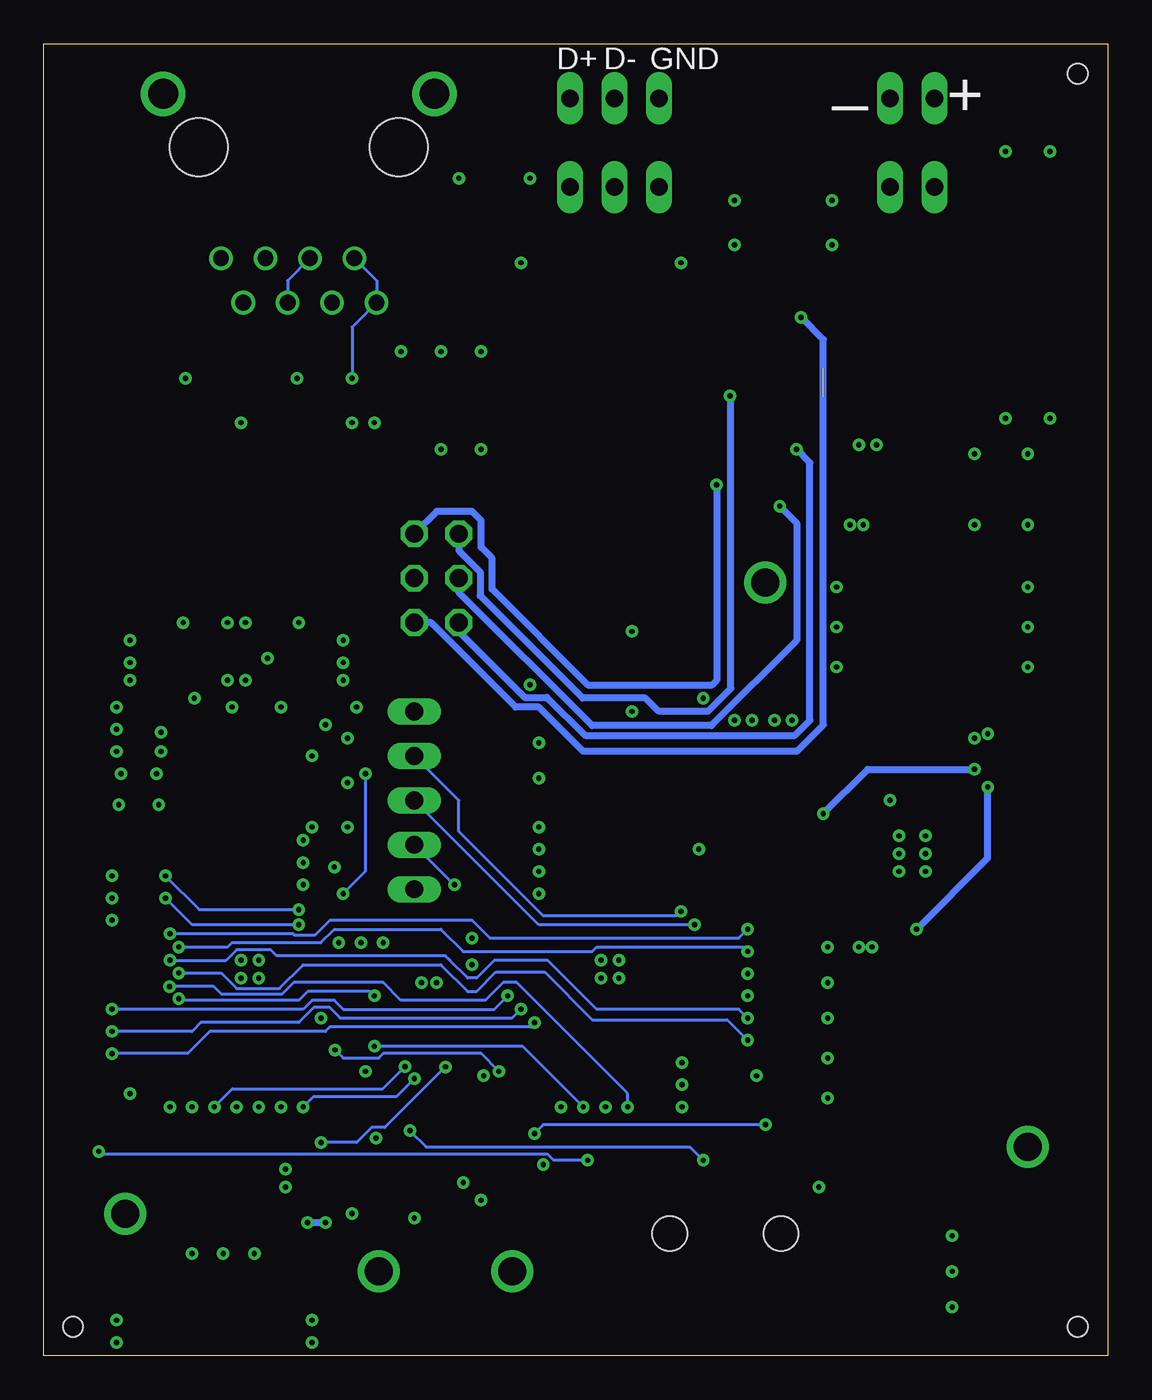
[diagram p4: board, bottom side, seen from below]

Size 60.8 x 75 mm. Coordinates in mm from the lower left corner, seen from the top.
Outline: 0,0 60.8,0 60.8,75 0,75 0,0
Copper layers (1+2*15+16): Top 0.035mm / dielectric 1.5mm / Route2 0.035mm / dielectric 0.15mm / Route15 0.035mm / dielectric 0.2mm / Bottom 0.035mm
Design rules "default *": minimum track width 6mil, minimum drill 12mil, track to track 6mil, track to pad 6mil, pad to pad 6mil, via to via 6mil, smd to smd 6mil, copper to edge 0mil, drill to drill 6mil, minimum pad ring 0.13mm, minimum via ring 8mil, stop-mask expansion 4mil, vias tented up to drill 12mil, thermal gap 10mil
Holes 1.15 mm at 1.73,1.66 1.73,73.29 59.13,1.66
tRestrict: area 0.7,0.6 to 2.7,2.7; area 0.7,72.3 to 2.7,74.3; area 58.1,0.6 to 60.1,2.7; area 2.9,69.9 to 5.1,72.1; area 55.7,69.9 to 57.9,72.1; area 55.7,3.4 to 57.9,5.6
bRestrict: area 16.9,5.2 to 20.4,8.8; area 23.2,5.2 to 26.8,8.8

### Footprints (pad centres in the part's own frame; a part is rotated, then mirrored left to right if it is on the bottom)
0402_INDUCTOR = smd 0.6 x 0.7: P$1 0.5,0; P$2 -0.5,0
0603 = smd 1.1 x 1: 1 -0.85,0; 2 0.85,0
C1206 = smd 1.6 x 1.8: 1 -1.4,0; 2 1.4,0
0603_DIODE = smd 1.1 x 1: A -0.85,0; K 0.85,0
DO-214AC = smd 1.5 x 1.6: A -1.8,0; C 1.8,0
SC-70-5 = smd 0.85 x 0.35: 1 -1.1,0.65; 2 -1.1,0; 3 -1.1,-0.65; 4 1.1,-0.65; 5 1.1,0.65
SOD123(AK) = smd 1.1 x 1.1: A 1.45,0; K -1.45,0
1206 = smd 1.6 x 1.8: 1 -1.4,0; 2 1.4,0
MICRO_USB = smd 0.4 x 1.6: 1 -1.3,0; 2 -0.65,0; 3 0,0; 4 0.65,0; 5 1.3,0 | smd 10 x 1.9: GND 0,-2.84
A-2004-2-4-LPS-N-R = drill 0.9: 1 4.445,-6.35; 2 3.175,-8.89; 3 1.905,-6.35; 4 0.635,-8.89; 5 -0.635,-6.35; 6 -1.905,-8.89; 7 -3.175,-6.35; 8 -4.445,-8.89 | drill 1.7: S1 -7.75,3.05; S2 7.75,3.05 | hole 3.35: -5.715,0; 5.715,0
KF141R-2.54-3P = drill 1 long: 1A -2.54,-2.54; 1B -2.54,2.54; 2A 0,-2.54; 2B 0,2.54; 3A 2.54,-2.54; 3B 2.54,2.54
KF141R-2.54-2P = drill 1 long: 1A -1.27,-2.54; 1B -1.27,2.54; 2A 1.27,-2.54; 2B 1.27,2.54
1X05 = drill 1.016 long: 1 -5.08,0; 2 -2.54,0; 3 0,0; 4 2.54,0; 5 5.08,0
2X03 = drill 1.016 octagon: 1 -2.54,-1.27; 2 -2.54,1.27; 3 0,-1.27; 4 0,1.27; 5 2.54,-1.27; 6 2.54,1.27
SNR5040 = smd 4.7 x 1.6: P$1 0,-1.8; P$2 0,1.8
SMCM090605 = smd 1.2 x 2: IN1 -1.27,3.8; IN2 1.27,3.8; OUT1 -1.27,-3.8; OUT2 1.27,-3.8
TMPC0603H = smd 2.95 x 3.5: P$1 -4.2,0; P$2 4.2,0
5151069F = hole 2.007: -3.175,0; 3.175,0
R0402 = smd 0.6 x 0.7: 1 -0.5,0; 2 0.5,0
TDK_ALT = smd 1.2 x 0.41: 1 -2,-1.35; 2 -2,-0.7; 4 2,1.35; 5 2,0.7 | smd 1.2 x 0.5: 3 -2,1.35; 6 2,-1.35
H1102NLT = smd 0.762 x 1.651: 1 -4.445,-4.255; 2 -3.175,-4.255; 3 -1.905,-4.255; 4 -0.635,-4.255; 5 0.635,-4.255; 6 1.905,-4.255; 7 3.175,-4.255; 8 4.445,-4.255; 9 4.445,4.255; 10 3.175,4.255; 11 1.905,4.255; 12 0.635,4.255; 13 -0.635,4.255; 14 -1.905,4.255; 15 -3.175,4.255; 16 -4.445,4.255
5010 = drill 1.6: P$1 0,0
QFN32-55_TI = smd 1 x 0.25: 1 -2.6,1.75; 2 -2.6,1.25; 3 -2.6,0.75; 4 -2.6,0.25; 5 -2.6,-0.25; 6 -2.6,-0.75; 7 -2.6,-1.25; 8 -2.6,-1.75; 17 2.6,-1.75; 18 2.6,-1.25; 19 2.6,-0.75; 20 2.6,-0.25; 21 2.6,0.25; 22 2.6,0.75; 23 2.6,1.25; 24 2.6,1.75 | smd 0.25 x 1: 9 -1.75,-2.6; 10 -1.25,-2.6; 11 -0.75,-2.6; 12 -0.25,-2.6; 13 0.25,-2.6; 14 0.75,-2.6; 15 1.25,-2.6; 16 1.75,-2.6; 25 1.75,2.6; 26 1.25,2.6; 27 0.75,2.6; 28 0.25,2.6; 29 -0.25,2.6; 30 -0.75,2.6; 31 -1.25,2.6; 32 -1.75,2.6 | smd 2.1 x 2.1: EP 0,0
3.2X2.5_4SMD = smd 1 x 0.9: 1 -1.2,-0.9; 2 1.2,-0.9; 3 1.2,0.9; 4 -1.2,0.9
SOIC8_TP_TI = smd 1.981 x 0.533: 1 -2.87,1.905; 2 -2.87,0.635; 3 -2.87,-0.635; 4 -2.87,-1.905; 5 2.87,-1.905; 6 2.87,-0.635; 7 2.87,0.635; 8 2.87,1.905 | smd 2.4 x 3.1: TP 0,0
SC-70 = smd 0.85 x 0.35: 1 -1.1,0.65; 2 -1.1,0; 3 -1.1,-0.65; 4 1.1,-0.65; 5 1.1,0; 6 1.1,0.65

### Placement (x,y rotation side)
C1  31.24,27.69 180 top
C2  31.24,28.96 180 top
C3  31.24,30.23 180 top
C4  25.65,16.76 0 top
C5  25.65,15.49 0 top
C6  25.65,14.22 0 top
C7  31.24,26.42 180 top
C8  27.43,45.47 0 top
C9  30.73,45.47 0 top
C10  31.75,32 0 top
C11  25.15,41.4 180 top
C12  24.38,59.69 90 top
C13  33.53,59.69 90 top
C14  18.29,55.63 90 top
C15  26.16,36.83 270 top
C16  33.02,40.39 90 top
C17  16.51,28.19 270 top
C18  43.94,22.35 270 top
C19  42.67,22.35 270 top
C20  12.95,22.35 0 top
C21  41.4,22.35 270 top
C22  47.24,28.19 0 top
C23  47.24,29.46 0 top
C24  36.32,10.92 180 top
C25  23.11,15.24 90 top
C26  46.23,31.24 180 top
C27  39.12,22.35 180 top
C28  43.43,19.3 180 top
C29  44.7,39.12 90 top
C30  43.43,15.75 270 top
C31  44.2,37.08 0 top
C32  55.37,37.08 180 top
C33  49.78,40.89 0 top
C34  55.37,34.54 180 top
C35  49.78,39.62 180 top
C36  55.37,35.81 180 top
C37  40.39,54.61 90 top
C38  20.83,33.53 90 top
C39  20.83,28.19 270 top
C40  18.54,28.19 270 top
C41  18.54,33.53 90 top
C42  12.7,40.64 0 top
C43  7.37,38.35 180 top
C44  12.7,38.35 0 top
C45  7.37,40.64 180 top
C46  12.7,45.21 0 top
C47  12.95,20.32 0 top
C48  11.18,52.07 0 top
C49  47.24,26.92 0 top
C50  7.37,42.93 180 top
C51  12.7,42.93 0 top
C52  7.37,45.21 180 top
C53  38.1,54.61 270 top
C54  5.84,27.43 270 top
C55  12.95,18.29 0 top
C56  12.95,16 0 top
C57  12.95,13.72 0 top
C58  54.86,39.12 90 top
C59  36.83,8.38 90 top
C60  45.97,10.16 90 top
C61  42.93,27.94 180 top
C62  18.54,63.5 180 top
CR1  15.49,10.41 90 top
CR2  21.84,10.41 90 top
CR3  28.19,10.41 90 top
CR4  6.1,49.78 270 top
D1  47.24,37.59 0 top
D2  52.32,37.59 0 top
D3  48.26,7.62 0 top
D4  11.18,50.04 180 top
D5  16.26,57.91 90 top
D6  20.32,57.91 90 top
D7  20.32,53.34 90 top
D8  16.26,53.34 90 top
D10  29.46,36.83 0 top
F1  20.07,48.51 270 top
F2  17.27,48.51 270 top
J1  51.05,4.32 0 top
J2  46.23,69.09 0 top
J3  28.19,69.34 180 top
J4  11.18,69.34 180 top
JP1  39.62,31.75 90 top
JP2  38.35,44.45 90 top
L2  32,49.78 90 top
L3  28.96,58.17 0 top
L4  11.18,58.17 0 top
L5  25.91,49.78 270 top
L6  6.86,19.81 90 top
LP1  21.84,6.99 0 top
R1  31.75,34.04 0 top
R2  21.08,15.24 90 top
R3  22.1,18.03 180 top
R4  22.1,19.3 180 top
R5  22.1,23.11 180 top
R6  22.1,24.38 180 top
R7  51.05,15.75 90 top
R8  55.37,17.27 180 top
R9  55.37,18.54 180 top
R10  55.37,19.81 180 top
R11  27.43,15.75 270 top
R12  45.97,15.75 90 top
R13  29.97,15.75 270 top
R14  44.7,15.75 90 top
R15  45.21,40.89 0 top
R16  47.5,40.89 0 top
R17  10.92,2.79 180 top
R18  52.07,40.89 0 top
R19  29.46,28.45 270 top
R20  28.19,28.45 270 top
R21  26.92,28.45 270 top
R22  10.92,6.86 0 top
R23  25.65,28.45 270 top
R24  24.13,36.83 90 top
R25  25.15,39.37 0 top
R26  34.8,22.35 0 top
R27  28.7,15.75 270 top
R28  34.8,23.88 180 top
R29  22.1,20.57 180 top
R30  22.1,21.84 180 top
R31  31.24,15.75 270 top
R32  46.35,54.61 90 top
R33  52.7,54.61 90 top
R34  10.92,4.83 180 top
R35  33.53,55.37 270 top
R36  24.38,55.37 270 top
R37  55.37,27.43 180 top
R38  42.93,31.75 0 top
R39  55.37,24.89 0 top
R40  42.93,29.21 0 top
R41  43.43,20.57 0 top
R42  39.12,20.32 180 top
R43  46.23,33.27 180 top
R44  33.78,15.75 90 top
R45  33.78,13.21 270 top
R46  33.78,10.92 180 top
R47  55.37,16 0 top
R48  55.37,26.16 0 top
R49  53.59,15.75 90 top
R50  47.24,15.75 90 top
R51  49.78,15.75 270 top
R52  48.51,15.75 90 top
R53  52.32,15.75 270 top
R54  42.93,34.29 0 top
R55  24.38,28.45 270 top
R56  54.36,40.89 0 top
R57  35.81,54.61 90 top
R58  40.64,10.16 90 top
R59  44.2,10.16 90 top
R60  43.18,54.61 90 top
R61  55.37,32.26 270 top
R62  9.65,35.31 0 top
R63  49.53,54.61 90 top
R64  11.18,48.01 180 top
R65  18.54,66.04 0 top
R66  9.65,32.77 180 top
R67  13.21,32.77 0 top
R68  5.84,31.5 90 top
R69  5.84,34.8 270 top
R70  12.95,24.38 0 top
R71  35.05,67.31 0 top
T1  29.46,41.4 270 top
T4  49.53,47.75 0 top
TP1  4.57,11.94 180 top
TP2  56.13,8.13 90 top
TP3  19.56,44.2 0 top
TP4  41.66,4.83 0 top
TP5  34.04,4.83 0 top
U1  28.45,22.1 270 top
U2  49.02,22.1 180 top
U3  36.58,13.97 180 top
U4  11.18,28.7 180 top
U5  42.42,10.16 270 top
U6  38.86,10.16 90 top

### Tracks (layer width: path | path; a pad name or v marks a point on that pad's centre or on a via)
3V3R  (via drill 0.3)
  Top 0.406: v6.86,32.51 6.01,32.51 R68.2 | R70.1 v10.92,24.38
  Bottom 0.406: v10.92,24.38 6.86,28.45 v6.86,32.51
  pour Top (no thermals): 5.33,14.22 10.92,14.22 10.92,12.95 12.7,12.95 12.7,24.64 10.67,24.64 10.67,17.02 5.33,17.02
!RST  (via drill 0.3)
  Top 0.18: U2.18 45.64,23.35 45.37,23.62 45.37,26.26 44.45,27.18 43.02,27.18 42.43,27.78 C61.P$1 R40.1 JP1.2 | U1.31 33.55,23.35 33.78,23.11 36.58,23.11 37.34,23.88 v37.34,26.92
  Bottom 0.18: v37.34,26.92 JP1.2
+3V3  (via drill 0.3)
  Top 0.152: CR1.A 16.42,9.56 v16.51,9.65
  Top 0.18: R47.2 v55.88,14.99 | R48.2 v56.9,26.16 | R39.2 v56.9,24.89 | R53.2 v52.32,14.22 | R51.2 v49.78,14.22 | R26.2 v36.32,22.35 | R30.2 v20.57,21.84 | R29.2 v20.57,20.57 | R27.2 v28.7,14.22 | R31.2 v31.24,14.22 | R54.2 43.43,35.3 v43.43,35.31 | R38.2 43.43,32.76 v43.43,32.77 | R40.2 43.43,30.22 v43.43,30.23 | C60.P$1 45.98,10.67 v46.99,10.67 | U6.6 38.21,10.26 C59.P$1 35.82,8.88 v35.81,8.89
  Top 0.254: v54.23,31.5 54.32,31.41 R61.2 56.43,31.41 v56.52,31.5 | U5.6 43.07,8.24 v43.18,8.13
  Top 0.406: 45.38,33.36 R43.2 45.38,34.2 v45.47,34.29 | R24.2 23.2,37.68 v23.11,37.59 | R34.2 v8.89,4.83 | R17.2 v8.89,2.79 | R42.2 38.27,21.25 v38.35,21.34 | R2.2 20.15,16.09 v20.07,16 | R46.2 v32.26,10.92 | v13.46,23.37 13.46,24.04 R70.2 14.22,23.96 v14.22,23.37 | R1.2 32.51,34.12 v32.51,35.05
  pour Route15 (rank 3): 0.51,0.51 60.2,0.51 60.2,44.2 42.42,44.2 42.42,50.29 39.12,50.29 39.12,54.1 34.92,54.1 34.92,44.2 30.99,44.2 30.99,40.39 29.72,40.39 29.72,38.61 22.61,38.61 22.61,44.45 23.88,44.45 23.88,52.83 22.1,52.83 22.1,61.98 18.29,61.98 18.29,74.17 14.73,74.17 14.73,52.83 7.62,52.83 7.62,74.17 0.51,74.17 0.51,48.51 15.75,48.51 15.75,45.72 0.51,45.72
BS  (via drill 0.3)
  Top 0.18: v46.33,55.88 46.35,55.85 R32.2 | R60.1 v43.18,53.34 | R63.1 v49.53,53.34 | R33.2 v52.7,55.88
  Top 0.406: C37.1 41.78,53.21 v41.91,53.34
  pour Route2: 56.39,74.17 35.31,74.17 35.31,54.86 39.88,54.86 39.88,51.05 56.39,51.05
CEXT_L
  Top 0.18: U1.2 29.7,25.53 | 29.7,25.53 29.7,25.89 30.23,26.42 C7.P$1 | 29.7,25.53 29.97,25.53 30.2,25.3 U1.1
CGND  (via drill 0.3)
  Top 0.406: R57.2 v35.81,57.4 | C53.1 v38.1,57.4 | C37.2 v40.39,57.4 | R71.2 v37.08,67.31
  pour Route15: 56.39,74.17 35.31,74.17 35.31,54.86 39.88,54.86 39.88,51.05 56.39,51.05
CRS-2
  Top 0.18: U2.27 48.27,17.28 R50.2
EARTH  (via drill 0.3)
  Top 0.348: C12.2 v24.38,62.48 | C13.2 v33.53,62.48 | C62.1 v21.34,63.5 | R65.2 v21.34,66.04
  Top 0.406: C11.1 v27.18,41.4 | R71.1 v33.02,67.31
  pour Route2: 34.29,74.17 18.8,74.17 18.8,62.48 22.61,62.48 22.61,53.34 23.37,53.34 23.37,43.69 23.11,43.69 23.11,39.12 27.69,39.12 27.69,42.42 29.21,42.42 29.21,44.96 34.29,44.96
  pour Route15: 34.29,74.17 18.8,74.17 18.8,62.48 22.61,62.48 22.61,53.34 24.38,53.34 24.38,43.69 23.11,43.69 23.11,39.12 27.69,39.12 27.69,42.42 29.21,42.42 29.21,44.96 34.29,44.96
GND  (via drill 0.3)
  Top 0.152: D2.2 v52.2,37.59 | D1.2 46.91,37.59 47.24,37.25 v47.24,37.08 | U4.TP v10.41,28.7
  Top 0.18: U2.EP v48.51,21.59 | R49.1 v53.59,14.22 | R52.1 v48.51,14.22 | R50.1 v47.24,14.22 | C30.P$2 v42.42,16.26 | R28.1 v36.32,23.88 | C28.P$2 v44.96,19.3 | R37.1 v56.9,27.43 | R55.1 23.38,28.95 v23.37,28.96 | U5.3 41.77,12.39 v41.82,12.45 | C60.P$2 v46.98,9.66 v46.99,9.65 | C59.P$2 39.41,7.88 39.51,7.99 | C61.P$2 v44.2,27.94
  Top 0.254: D10.2 v27.18,36.83 | C31.P$2 v42.93,37.08 | C29.P$2 44.7,38.61 v43.69,38.61 | C33.P$2 v49.28,41.91 | C35.P$2 v50.29,38.61 | C58.P$2 54.87,38.61 v55.88,38.61 | C32.P$2 v56.64,37.08 | C36.P$2 v56.64,35.81 | C34.P$2 v56.64,34.54 | U6.3 39.51,7.99 v39.62,7.87
  Top 0.348: R65.1 v15.75,66.04 | C62.2 v15.75,63.5
  Top 0.406: C15.1 27.01,36.83 v27.18,36.83 | U4.1 12.83,26.8 v11.94,27.69 | R22.1 v8.89,6.86 | v6.86,35.56 6.77,35.65 R69.1 | R67.1 12.45,32.68 v12.45,31.75 | U1.EP v27.94,22.61 | C27.2 38.57,22.05 38.65,22.05 39.22,21.48 v39.22,21.34 | C21.P$2 v41.4,23.62 | C19.P$2 v42.67,23.62 | C18.P$2 v43.94,23.62 | C49.P$2 v45.97,26.92 | C22.P$2 v45.97,28.19 | C23.P$2 v45.97,29.46 | C26.2 45.47,31.15 v45.47,30.23 | C7.P$2 v32.51,26.42 | C1.P$2 v32.51,27.69 | C2.P$2 v32.51,28.96 | C3.P$2 v32.51,30.23 | C6.P$2 v24.33,14.22 | C5.P$2 v24.33,15.49 | C4.P$2 v24.33,16.76 23.66,16.09 C25.2 | C24.P$2 v36.83,9.91 | L4.OUT2 12.45,52.49 C48.2 v13.21,52.07 v14.22,52.07 | C10.2 32.51,32.09 v32.51,33.02 | C16.1 v33.02,38.35 | v7.62,51.56 6.12,51.56 CR4.A 6.07,51.56 v4.57,51.56 | R62.1 v7.62,35.31 | C53.2 v38.1,51.82 | R57.1 v35.81,51.82 | U3.2 35.38,15.72 v35.66,16
  other vias: 48.51,22.61 49.53,22.61 49.53,21.59 27.94,21.59 28.96,22.61 28.96,21.59 11.94,28.7 11.94,29.72 10.41,29.72 10.41,27.69 50.55,5.84 48.77,5.84 52.32,5.84 56.64,2.03 56.64,0.76 45.47,0.76 45.47,2.03 16,19.3 16,17.02 16,14.73 16,21.34 16,23.37 4.57,39.37 4.57,41.66 4.57,43.94 15.49,43.94 15.49,41.66 15.49,39.37 18.03,36.32 19.05,36.32 21.34,36.32 20.32,36.32 3.3,53.59 5.84,53.59 5.84,68.83 3.3,68.83
  pour Route2 (rank 5): 0.51,74.17 18.29,74.17 18.29,61.98 22.1,61.98 22.1,52.83 22.86,52.83 22.86,44.45 22.61,44.45 22.61,38.61 29.72,38.61 29.72,40.39 30.99,40.39 30.99,44.2 34.92,44.2 34.92,54.1 39.12,54.1 39.12,50.29 42.42,50.29 42.42,44.2 60.2,44.2 60.2,0.51 0.51,0.51
  cutout Route2: 14.48,53.09 7.87,53.09 7.87,74.93 14.48,74.93
  pour Top (no thermals): 58.42,0.51 43.69,0.51 43.69,6.1 57.4,6.1 58.17,6.1 58.42,6.1
  pour Top: 6.35,69.34 6.35,53.09 2.79,53.09 2.79,69.34
  pour Top (no thermals): 13.21,12.95 18.03,12.95 18.03,23.62 20.07,25.65 22.61,25.65 22.61,27.94 15.75,27.94 15.24,27.43 10.16,27.43 10.16,25.15 14.73,25.15 14.73,22.86 13.21,22.86
  pour Top (no thermals): 13.46,37.59 15.75,37.59 16,37.59 16,45.97 13.46,45.97
  cutout Route15: 14.48,53.09 7.87,53.09 7.87,74.93 14.48,74.93
  pour Top (no thermals): 4.06,37.59 6.35,37.59 6.6,37.59 6.6,45.97 4.06,45.97
  pour Top (no thermals): 21.84,34.29 21.84,36.83 17.53,36.83 17.53,34.29
GPIO1-1
  Top 0.18: U1.32 34.27,23.85 R28.2
GPIO2-1
  Top 0.18: U1.8 26.7,25.37 24.38,27.69 R55.2
IN+  (via drill 0.3)
  Top 0.348: D6.K 20.31,56.48 C14.2
  Top 0.406: 20.65,54.79 D7.A | D6.K D7.A | L2.P$1 35.31,49.78 37.08,48.01 JP2.6 | D7.A 20.39,54.86 v21.59,54.86
  Bottom 0.406: JP2.6 37.08,46.03 35.87,44.81 35.87,43.46 30,37.59 26.42,37.59 25.65,36.83 22.86,36.83 21.54,38.15 21.54,54.81 v21.59,54.86
IN+L
  Top 0.348: R35.2 30.23,54.52 L3.OUT2 30.23,49.81 L2.P$2 30.2,46.85 C9.2
IN-  (via drill 0.3)  (1 unrouted)
  Top 0.406: L5.P$1 v22.35,49.78 22.35,52.07 21.08,53.34 19.72,53.34 C14.1 16.27,54.78 D8.A
  Bottom 0.406: v22.35,49.78 22.35,38.61 22.61,38.35 29.72,38.35 35.18,43.81 35.18,45.59 35.81,46.23 35.81,47.75 36.32,48.26 38.35,48.26 JP2.5
IN-L
  Top 0.348: R36.2 27.69,54.52 L3.OUT1 27.71,54.34 L5.P$2 27.71,49.53 27.71,46.59 C8.1
LED0-1  (via drill 0.3)
  Top 0.18: U1.29 R26.1 37.85,18.8 38.86,18.8 40.89,16.76 40.89,13.88 v39.88,12.86 | v23.11,11.18 21.93,11.18 CR2.K
  Bottom 0.18: v39.88,12.86 38.95,11.94 23.88,11.94 v23.11,11.18
LED0-2  (via drill 0.3)
  Top 0.152: U2.17 46.42,24.44 v46.23,24.64 | v29.72,11.18 28.28,11.18 CR3.K
  Top 0.18: v53.85,26.16 R48.1 | R48.1 | v57.66,11.68 57.66,25.15 57.31,25.49 55.28,25.49 54.86,25.91 R48.1
  Bottom 0.18: v46.23,24.64 52.32,24.64 v53.85,26.16 | v29.72,11.18 31.67,11.18 32.01,11.52 57.49,11.52 v57.66,11.68
MDC  (via drill 0.3)
  Top 0.18: U2.20 45.47,22.35 44.7,23.11 44.7,23.88 40.64,27.94 38.1,27.94 37.59,28.45 37.59,30.48 38.86,31.75 JP1.3 R38.1 | U1.12 25.15,22.35 23.62,23.88 v23.62,24.64
  Bottom 0.18: v23.62,24.64 32.51,24.64 JP1.3
MDIO  (via drill 0.3)
  Top 0.18: U2.19 45.43,22.86 45.04,23.25 45.04,24.78 43.69,26.12 v43.69,26.42 | v42.42,33.27 42.42,34.28 R54.1 JP1.4 | U1.11 25.12,22.85 24.38,23.59 v24.38,25.4
  Bottom 0.18: v43.69,26.42 42.42,27.69 v42.42,33.27 | v24.38,25.4 24.64,25.15 32.26,25.15 37.08,29.97 37.08,31.75 JP1.4
N$1
  Top 0.406: L4.OUT1 9.91,52.49 C48.1 10.33,51.22 9.73,50.62 D4.A
N$2
  Top 0.348: T1.1 28.11,45.3 C8.2
N$3
  Top 0.152: R17.1 24.64,2.79 28.19,6.35 CR3.A
N$4
  Top 0.18: R63.2 49.53,56.9 46.86,59.56 J2.4
  Bottom 0.18: J2.5 46.86,61.47 J2.4
N$5  (via drill 0.3)
  Top 0.18: v43.18,55.88 R60.2
  Bottom 0.18: J2.7 41.78,61.47 J2.8 43.18,58.8 v43.18,55.88
N$6
  Top 0.152: R34.1 12.95,4.83 17.69,9.56 CR2.A
N$9
  Top 0.18: U1.21 28.7,18.79 R31.1
N$10
  Top 0.406: J1.1 49.75,7.58 D3.A
N$12
  Top 0.406: L4.IN2 J4.1B J4.1A
N$13
  Top 0.18: U2.25 47.27,18.82 R14.2
N$14
  Top 0.348: T1.2 28.76,44.21 29.88,45.33 C9.1
N$16
  Top 0.406: T1.6 28.08,39.37 R25.2
N$19
  Top 0.152: CR1.K 14.31,11.26 13.21,10.16 13.21,7.37 12.7,6.86 R22.2
N$23
  Top 0.406: F2.1 17.15,50.04 D4.K
N$24
  Top 0.18: U2.26 47.77,18.05 R12.2
N$25  (via drill 0.3)
  Top 0.18: U2.3 52.62,21.35 52.86,21.1 v53.62,21.1 | R11.2 v27.43,14.22
  Bottom 0.18: v27.43,14.22 27.43,14.99 33.78,21.34 34.54,21.34 35.56,20.32 40.39,20.32 41.4,21.34 46.52,21.34 47.2,20.66 50.63,20.66 51.08,21.1 v53.62,21.1
N$27
  Top 0.18: U4.2 12.83,28.07 12.62,28.27 12.62,30.56 10.5,32.68 R66.1 R62.2
N$29
  Top 0.18: R32.1 T4.15
N$30  (via drill 0.3)
  Top 0.18: U2.7 52.22,23.35 52.84,23.97 53.43,23.97 v53.59,24.13 | v20.57,24.38 R6.2
  Bottom 0.18: v20.57,24.38 21.08,23.88 35.31,23.88 35.81,24.38 35.9,24.47 36.32,24.89 44.45,24.89 45.3,24.04 46.48,24.04 46.57,24.13 v53.59,24.13
N$31  (via drill 0.3)
  Top 0.18: U2.6 52.57,22.85 v53.09,23.37 | R5.2 v20.57,23.11
  Bottom 0.18: v53.09,23.37 50.29,23.37 50.04,23.62 44.96,23.62 44.2,24.38 38.1,24.38 36.83,23.11 29.46,23.11 29.21,23.37 20.83,23.37 v20.57,23.11
N$32  (via drill 0.3)
  Top 0.18: U2.5 52.7,22.35 52.84,22.48 53.47,22.48 v53.59,22.61 | R4.2 v20.57,19.3
  Bottom 0.18: v53.59,22.61 50.38,22.61 49.78,23.2 47.84,23.2 47.5,22.86 37.85,22.86 37.68,22.7 37.59,22.61 36.58,21.59 36.07,21.59 35.05,22.61 32,22.61 29.21,19.81 21.08,19.81 v20.57,19.3
N$33  (via drill 0.3)
  Top 0.18: U2.4 53.05,21.85 v53.09,21.88 | R3.2 v20.57,18.03
  Bottom 0.18: v20.57,18.03 21.75,19.21 29.46,19.21 32.18,21.93 34.96,21.93 36.07,20.83 36.58,20.83 38.1,22.35 45.97,22.35 47.33,20.99 49.78,20.99 50.67,21.88 v53.09,21.88
N$34
  Top 0.406: L4.IN1 J4.2B J4.2A
N$36
  Top 0.348: L3.IN2 30.23,64.01 30.73,64.52 J3.1B J3.1A
N$37
  Top 0.406: R25.1 C11.2
N$38  (via drill 0.3)
  Top 0.18: U2.23 44.21,20.85 R41.2 44.44,20.07 45.21,20.07 45.72,19.56 45.72,19.05 v44.15,17.48 | R44.2 34.79,16.25 v34.8,16.26
  Bottom 0.18: v34.8,16.26 35.81,17.27 41.4,17.27 41.66,17.02 43.69,17.02 v44.15,17.48
N$40
  Top 0.406: T1.3 30.81,42.59 32.17,41.24 C16.2
N$42
  Top 0.348: R36.1 C12.1
N$48
  Top 0.348: R35.1 C13.1
N$49
  Top 0.348: L3.IN1 27.69,64 28.11,64.42 28.11,66.72 J3.2B J3.2A
N$50
  Top 0.254: D10.3 26.36,36.18 C15.2
  Top 0.406: R24.1 C15.2
N$58
  Top 0.18: U2.8 52.25,23.85 53.29,24.89 R39.1
N$59
  Top 0.152: U4.5 5.88,30.61 R68.1 5.08,31.41 5.08,33.19 R69.2
N$60  (via drill 0.3)
  Top 0.152: U2.16 47.27,25.12 46.89,25.5 v46.23,25.5
  Top 0.18: R37.2 v53.85,27.43
  Bottom 0.18: v53.85,27.43 51.92,25.5 v46.23,25.5
N$61
  Top 0.152: R45.1 34.04,13.71 34.68,13.07 U3.3
  Top 0.18: R44.1 R45.1
N$62
  Top 0.406: R46.1 C24.P$1 35.82,11.68 36.08,11.94 37.59,11.94 37.85,12.19 37.85,13 U3.4
N$63  (via drill 0.3)
  Top 0.18: U1.10 25.83,23.37 25.07,23.37 24.72,23.72 24.72,24.89 24.98,25.15 24.98,25.65 24.63,26 23.71,26 22.86,25.15 20.32,25.15 19.3,24.13 19.3,13.46 v19.56,13.21 | v32.77,12.7 v32.77,12.71 R45.2
  Bottom 0.18: v32.77,12.7 32.26,13.21 v19.56,13.21
N$64
  Top 0.18: T4.10 R33.1
N$68
  Top 0.406: U4.7 6.06,28.07 C54.1
N$71
  Top 0.18: U4.4 14.9,30.61 14.9,32.77 R67.2
RD_N
  Top 0.18: U2.9 50.77,25.56 50.69,25.64 50.69,32.36 arc-45 51.43,34.16 53.41,36.14 arc-45 53.67,36.25 arc45 53.93,36.35 54.13,36.55 arc45 54.25,36.86 54.25,37.11 arc45 54.04,37.62 D2.5 53.04,38.62 53.04,40.08 arc-45 R56.1 arc45 53.98,41.18 T4.8
RD_P
  Top 0.18: U2.10 50.27,25.56 50.36,25.64 50.36,32.36 arc-45 51.2,34.4 53.2,36.4 arc45 D2.4 arc45 53.2,37.48 52.87,37.81 arc-45 52.7,38.2 52.7,40.57 arc45 R18.2 52.18,41.28 arc-45 51.44,43.08 T4.6
RTN  (via drill 0.3)
  Top 0.406: D5.A v17.53,59.36 D6.A
  Bottom 0.406: JP2.1 38.66,41.91 33.84,37.08 32.51,37.08 29.97,34.54 17.78,34.54 16.26,36.07 16.26,58.09 v17.53,59.36
RX_CLK-1
  Top 0.18: U1.19 27.7,18.52 R13.1
RX_D0-1
  Top 0.18: U1.16 24.92,20.35 R3.1
RX_D0-2
  Top 0.18: U2.30 49.77,17.53 R7.2 R53.1 R49.2
RX_D1-1
  Top 0.18: U1.15 22.87,20.85 R29.1 R4.1
RX_D1-2
  Top 0.18: U2.31 50.27,18.05 51.05,17.27 R8.2 R47.1
RX_D2-1
  Top 0.18: R5.1 R30.1 23.09,21.35 U1.14
RX_D2-2
  Top 0.18: U2.32 50.77,18.32 51.05,18.03 54.36,18.03 R9.2
RX_D3-1
  Top 0.18: U1.13 25.14,21.85 R6.1
RX_D3-2
  Top 0.18: U2.1 52.3,20.35 52.83,19.81 R10.2
RX_DV-1
  Top 0.18: U1.18 27.2,16.48 R11.1 R27.1
RX_ER-2
  Top 0.18: U2.28 48.77,16.51 R52.2 R51.1
RX_N
  Top 0.348: J2.2 50.01,59.59 arc90 50.53,59.59 50.83,59.89 arc-90 51.35,59.89 51.36,59.88 arc-90 51.36,59.37 51.06,59.06 arc90 51.06,58.55 51.07,58.53 arc90 51.58,58.53 51.89,58.84 arc-90 52.4,58.84 52.41,58.83 arc-90 52.41,58.31 52.11,58.01 arc90 52.11,57.49 53.98,55.63 T4.9
RX_P
  Top 0.348: T4.11 51.44,56.06 48.28,59.21 48.28,60.86 50.16,62.74 J2.1
RXR_N
  Top 0.18: R21.2 26.92,27.43 27.7,26.66 U1.6
RXR_P
  Top 0.18: R20.2 U1.5
SW
  pour Top (no thermals): 8.64,26.92 5.08,26.92 5.08,22.61 8.64,22.61
T1L_N
  Top 0.18: T1.5 arc-45 30.23,39.25 30.23,38.3 arc45 D10.5 30.46,37.38 arc45 29.72,35.58 29.72,35.56 arc-45 29.36,34.69 28.34,33.67 28.21,33.51 arc45 27.39,31.54 27.39,30.13 26.92,29.66 R21.1 R23.1
T1L_P
  Top 0.18: T1.4 30.81,38.77 arc45 30.99,38.35 arc-45 31.24,37.74 31.24,37.08 arc-45 31.08,36.7 D10.4 30.13,35.74 arc45 30.05,35.56 arc-45 29.59,34.46 28.68,33.55 28.45,33.27 arc45 27.73,31.53 27.73,30.13 28.19,29.66 R20.1 R19.1
TCT  (via drill 0.3)
  Top 0.152: T4.2 46.35,42.04 v46.23,41.91 | T4.7 52.7,42.04 v52.83,41.91
  Top 0.18: v43.69,39.62
  Top 0.254: D2.3 50.18,36.94 v50.04,37.08 | D1.3 44.7,36.94 | 44.7,36.94 C31.P$1 | 44.7,36.94 v44.7,36.07 | C29.P$1 v43.69,39.62 | R15.1 v43.69,40.89 | R16.2 48,39.88 v48.01,39.88 48.26,39.62 C35.P$1 v49.28,38.61 | R18.1 C33.P$1 v50.28,41.9 v50.29,41.91 | R56.2 v55.88,40.89 | C58.P$1 54.87,39.62 v55.88,39.62 | C34.P$1 v54.1,34.54 | v54.1,35.65 54.71,35.65 C36.P$1 C32.P$1 | v54.36,33.27 54.52,33.11 R61.1 56.22,33.11 v56.39,33.27
  pour Route15 (isolate 0.254): 43.18,35.81 52.83,35.81 52.83,32.51 60.2,32.51 60.2,44.2 43.18,44.2
TD_N
  Top 0.18: U2.11 49.77,25.56 49.69,25.64 49.69,35.85 arc45 48.94,37.64 D1.5 arc-45 47.96,38.4 47.5,38.86 arc-45 47,40.07 R16.1 arc45 47.62,42.41 T4.3
TD_P
  Top 0.18: U2.12 49.27,25.56 49.36,25.64 49.36,34.88 arc45 48.61,36.67 D1.4 47.72,37.57 arc-45 47.5,38.1 arc45 47.29,38.6 46.22,39.67 arc-45 R15.2 arc-45 45.09,42.41 T4.1
TX_CLK-1  (via drill 0.3)
  Top 0.18: U1.22 29.2,18.76 30.43,17.53 37.08,17.53 37.85,16.76 v37.85,16.51 | U5.4 41.77,9.51 42.16,9.91 43.95,9.91 R59.1 44.7,9.65 44.96,9.91 v44.96,12.19
  Bottom 0.18: v44.96,12.19 42.92,12.19 42.07,13.04 41.31,13.04 v37.85,16.51
TX_CLK-1_RC
  Top 0.18: R14.1 C30.P$1 42.42,14.23 U5.2 42.42,10.67 42.67,10.41 43.95,10.41 R59.2
TX_CLK-2  (via drill 0.3)
  Top 0.18: U2.2 52.65,20.85 v53.09,20.41 | R41.1 v41.91,20.57 41.91,19.3 41.15,18.54 41.15,17.27 41.49,16.93 41.49,15.7 41.49,13.81 40.64,12.95 R58.2 40.04,11.26 U6.4
  Bottom 0.18: v41.91,20.57 42.16,20.83 45.72,20.83 46.23,20.32 53,20.32 v53.09,20.41
TX_CLK-2_RC  (via drill 0.3)
  Top 0.18: R13.2 v29.97,14.22 | C28.P$1 41.91,18.28 v41.91,17.69 41.91,16.59 41.82,16.5 41.82,15.84 41.83,15.83 41.83,13.38 41.22,12.77 41.22,12.2 41.35,12.07 41.35,11.43 41.35,11.18 41.35,10.37 R58.1 40.39,9.91 39.12,9.91 38.86,9.65 U6.2
  Bottom 0.18: v29.97,14.22 33.44,17.69 v41.91,17.69
TX_D0-1  (via drill 0.3)
  Top 0.18: R7.1 v51.05,14.22 | U1.24 30.2,18.82 30.73,18.29 38.4,18.29 v40.15,16.53
  Bottom 0.18: v40.15,16.53 41.42,15.26 50.02,15.26 v51.05,14.22
TX_D1-1  (via drill 0.3)
  Top 0.18: R8.1 v56.9,17.27 | U1.25 31.98,20.35 32.77,19.56 v32.77,19.05
  Bottom 0.18: v56.9,17.27 52.58,17.27 51.31,18.54 44.7,18.54 44.45,18.8 33.02,18.8 v32.77,19.05
TX_D2-1  (via drill 0.3)
  Top 0.18: R9.1 v56.9,18.54 | U1.26 32.49,20.85 v33.53,19.81
  Bottom 0.18: v56.9,18.54 52.32,18.54 51.82,19.05 46.23,19.05 45.38,19.9 44.46,19.9 43.86,19.3 34.04,19.3 v33.53,19.81
TX_D3-1  (via drill 0.3)
  Top 0.18: R10.1 v56.9,19.81 | U1.27 33.52,21.35 v34.29,20.57
  Bottom 0.18: v56.9,19.81 45.97,19.81 45.47,20.32 44.2,20.32 43.69,19.81 35.05,19.81 v34.29,20.57
TX_EN-1  (via drill 0.3)
  Top 0.18: R12.1 v45.97,14.22 | U1.23 29.72,19.48 29.72,18.71 30.57,17.86 37.6,17.86 v39.62,15.84
  Bottom 0.18: v45.97,14.22 45.38,14.82 40.64,14.82 v39.62,15.84
TX_N
  Top 0.348: T4.14 47.62,57.58 arc90 47.11,57.58 46.42,56.9 arc-90 45.91,56.9 45.88,56.93 arc-90 45.88,57.44 46.56,58.13 arc90 46.56,58.64 46.54,58.67 arc90 46.02,58.67 45.34,57.98 arc-90 44.82,57.98 44.79,58.01 arc-90 44.79,58.53 45.48,59.22 arc90 45.48,59.73 45.01,60.2 J2.6
TX_P
  Top 0.348: T4.16 45.09,56.83 43,58.91 43,60.71 43.87,61.57 46.97,61.57 J2.3
TXR_N
  Top 0.18: U1.7 27.2,25.89 25.65,27.43 R23.2
TXR_P
  Top 0.18: U1.4 28.7,26.67 29.46,27.43 R19.2
V+  (via drill 0.3)
  Top 0.406: v45.72,7.62 D3.K v44.7,7.62 | 6.07,48.01 CR4.C | CR4.C 5.61,47.5 v4.57,47.5 | CR4.C 6.58,47.5 v7.62,47.5 | F1.2 F2.2 15.12,47.11 v14.73,47.5 v13.97,47.5 13.08,47.5 R64.1
  Bottom 0.406: v45.72,7.62 v44.7,7.62
  pour Route15 (isolate 0.254): 47.75,8.38 47.75,0.51 0.51,0.51 0.51,48.01 15.24,48.01 15.24,46.23 3.3,46.23 3.3,2.29 40.39,2.29 40.39,6.6 43.94,6.6 43.94,8.38
V+F  (via drill 0.3)
  Top 0.406: v18.74,48.57 18.74,48.59 F1.1
  Bottom 0.406: v18.74,48.57 17.78,47.61 17.78,40.89 22.66,36.02 29.47,36.02 37.08,43.63 JP2.4
V+R  (via drill 0.3)
  Top 0.406: R66.2 8.38,32.77 v7.62,33.53 | R64.2 9.78,45.21 C52.1
  Bottom 0.406: v16.26,30.99 13.72,33.53 v7.62,33.53
  pour Top (rank 2, no thermals): 22.61,32.77 22.61,28.45 15.75,28.45 15.24,28.96 12.95,28.96 12.95,29.72 15.24,29.72 15.75,30.23 15.75,33.02 12.45,36.32 9.4,36.32 8.13,37.59 8.13,45.97 11.94,45.97 11.94,38.35 17.53,32.77
VDDA_L
  Top 0.254: U1.3 29.2,25.64 29.21,25.65
  Top 0.406: 29.21,25.65 29.21,26.42 30.48,27.69 C1.P$1 C2.P$1 C3.P$1 30.74,31.85 C10.1 R1.1
VDDA_L1
  Top 0.18: C18.P$1 43.69,21.85
  Top 0.254: U2.21 45.47,21.85 45.47,21.84
  Top 0.406: 45.47,21.84 44.11,21.84 44.1,21.85 43.69,21.85 C19.P$1 C21.P$1 40.47,21.85 | C27.1 40.47,21.85 | 40.47,21.85 40.47,20.82 R42.1
VDDIO_L
  Top 0.254: U1.17 26.7,18.57 26.67,18.54
  Top 0.406: 26.67,18.54 26.67,17.78 26.15,17.26 C4.P$1 C5.P$1 C6.P$1 26.15,13.71 25.91,13.46 23.88,13.46 23.11,14.22 C25.1 R2.1
VDDIO_L1
  Top 0.254: U2.14 48.26,25.65
  Top 0.406: 48.26,25.65 47.74,26.17 C49.P$1 C22.P$1 C23.P$1 47.74,29.98 47.08,30.65 C26.1 R43.1
VIN  (via drill 0.3)
  Top 0.406: D7.K D8.K 17.71,51.89 v17.78,51.82
  Bottom 0.406: JP2.2 37.08,41.41 33.31,37.64 32.05,37.64 29.87,35.46 17.88,35.46 17.02,36.32 17.02,51.05 v17.78,51.82
(copper drawn outside any net)
  shapes: Top circle x3

### Text on the board
tPlace: _ | + | 10BASE-T1L MEDIA CONVERTER w/ PoDL | GND | D- | D+ | MMXXIII | JLCJLCJLCJLC | PSE | PSE | GND | PD | PD | +3V3 | MDIO | MDC | RST | GND | DP83TD510 | DP83822 | GND | GND | +3V3 | +V
bPlace: _ | GND | D- | D+ | +
tNames: 6 | 5 | 4 | 3 | 2 | 1
tStop: 063